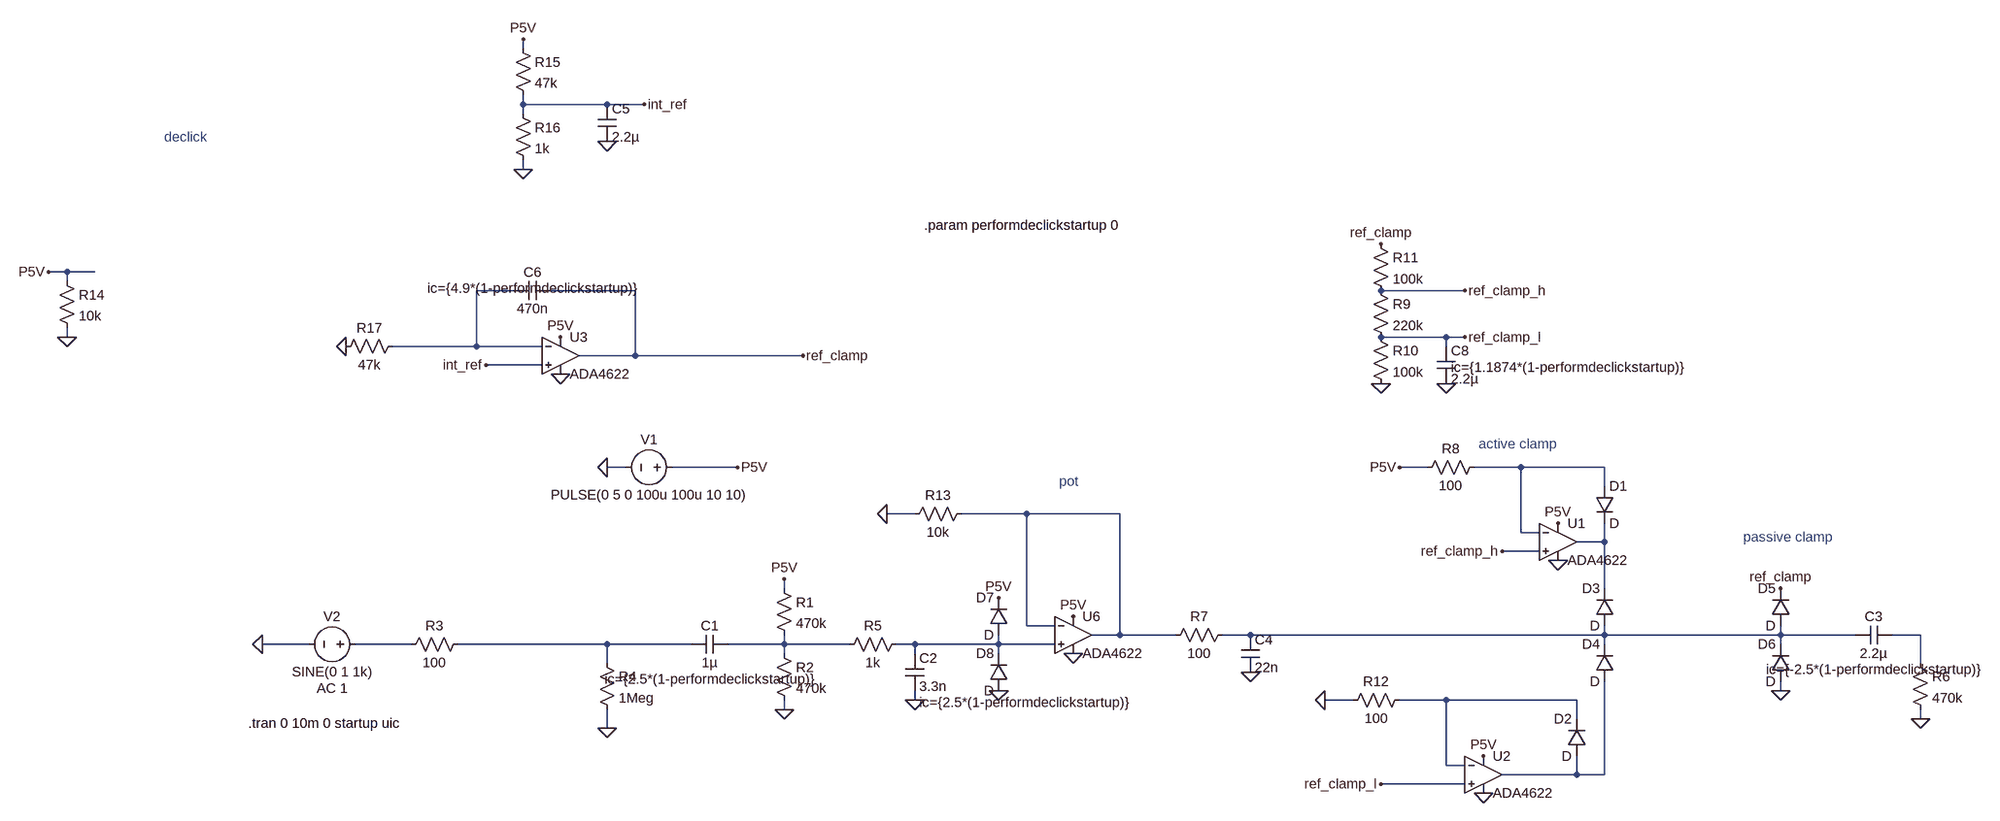
[diagram p0: schematic plugnslay.asc]
plugnslay.asc, the LTspice schematic file:
Version 4
SHEET 1 2460 852
WIRE -128 -560 -128 -576
WIRE -128 -464 -128 -480
WIRE 16 -464 -128 -464
WIRE 80 -464 16 -464
WIRE -128 -448 -128 -464
WIRE -128 -352 -128 -368
WIRE -976 -176 -1008 -176
WIRE -928 -176 -976 -176
WIRE -976 -160 -976 -176
WIRE -144 -144 -208 -144
WIRE 64 -144 -80 -144
WIRE 1488 -144 1344 -144
WIRE -976 -64 -976 -80
WIRE 1456 -64 1344 -64
WIRE 1488 -64 1456 -64
WIRE -208 -48 -208 -144
WIRE -208 -48 -352 -48
WIRE -96 -48 -208 -48
WIRE 1456 -48 1456 -64
WIRE 64 -32 64 -144
WIRE 64 -32 -32 -32
WIRE 352 -32 64 -32
WIRE -96 -16 -192 -16
WIRE 48 160 16 160
WIRE 240 160 128 160
WIRE 1424 160 1376 160
WIRE 1584 160 1504 160
WIRE 1728 160 1584 160
WIRE 1728 192 1728 160
WIRE 544 240 496 240
WIRE 736 240 624 240
WIRE 896 240 736 240
WIRE 1584 272 1584 160
WIRE 1616 272 1584 272
WIRE 1728 288 1728 256
WIRE 1728 288 1680 288
WIRE 1616 304 1552 304
WIRE 320 368 320 352
WIRE 1728 368 1728 288
WIRE 736 432 736 240
WIRE 784 432 736 432
WIRE 896 448 896 240
WIRE 896 448 848 448
WIRE 992 448 896 448
WIRE 1120 448 1072 448
WIRE 1728 448 1728 432
WIRE 1728 448 1120 448
WIRE 2080 448 2080 432
WIRE 2080 448 1728 448
WIRE 2208 448 2080 448
WIRE 2320 448 2272 448
WIRE -496 464 -576 464
WIRE -320 464 -416 464
WIRE 16 464 -240 464
WIRE 160 464 16 464
WIRE 320 464 320 448
WIRE 320 464 224 464
WIRE 432 464 320 464
WIRE 544 464 512 464
WIRE 688 464 688 448
WIRE 688 464 544 464
WIRE 784 464 688 464
WIRE 1728 464 1728 448
WIRE 2080 464 2080 448
WIRE 320 480 320 464
WIRE 544 480 544 464
WIRE 688 480 688 464
WIRE 16 496 16 464
WIRE 2320 496 2320 448
WIRE 2080 544 2080 528
WIRE 544 560 544 544
WIRE 1296 560 1248 560
WIRE 1456 560 1376 560
WIRE 1680 560 1456 560
WIRE 320 576 320 560
WIRE 1680 592 1680 560
WIRE 2320 592 2320 576
WIRE 16 608 16 576
WIRE 1456 672 1456 560
WIRE 1488 672 1456 672
WIRE 1680 688 1680 656
WIRE 1680 688 1552 688
WIRE 1728 688 1728 528
WIRE 1728 688 1680 688
WIRE 1488 704 1344 704
FLAG 16 160 0
FLAG 240 160 P5V
FLAG -576 464 0
FLAG 320 352 P5V
FLAG 320 576 0
FLAG 16 608 0
FLAG 816 416 P5V
FLAG 544 560 0
FLAG 1648 256 P5V
FLAG 1648 320 0
FLAG 1376 160 P5V
FLAG 1344 16 0
FLAG 1488 -144 ref_clamp_h
FLAG 1488 -64 ref_clamp_l
FLAG 1552 304 ref_clamp_h
FLAG 1520 656 P5V
FLAG 1520 720 0
FLAG 1344 704 ref_clamp_l
FLAG 1248 560 0
FLAG 2320 592 0
FLAG 1120 512 0
FLAG 2080 544 0
FLAG -1008 -176 P5V
FLAG -64 -64 P5V
FLAG -64 0 0
FLAG -976 -64 0
FLAG -128 -576 P5V
FLAG -128 -352 0
FLAG 80 -464 int_ref
FLAG -192 -16 int_ref
FLAG 816 480 0
FLAG 1456 16 0
FLAG -432 -48 0
FLAG 352 -32 ref_clamp
FLAG 1344 -224 ref_clamp
FLAG 2080 368 ref_clamp
FLAG 16 -400 0
FLAG 496 240 0
FLAG 688 384 P5V
FLAG 688 544 0
SYMBOL voltage 144 160 R90
WINDOW 0 -32 56 VBottom 2
WINDOW 3 32 56 VTop 2
WINDOW 123 0 0 Left 0
WINDOW 39 0 0 Left 0
SYMATTR InstName V1
SYMATTR Value PULSE(0 5 0 100u 100u 10 10)
SYMBOL cap 224 448 R90
WINDOW 0 0 32 VBottom 2
WINDOW 3 32 32 VTop 2
WINDOW 123 60 32 VTop 2
SYMATTR InstName C1
SYMATTR Value 1µ
SYMATTR Value2 ic={2.5*(1-performdeclickstartup)}
SYMBOL voltage -400 464 R90
WINDOW 0 -32 56 VBottom 2
WINDOW 3 32 56 VTop 2
WINDOW 123 60 56 VTop 2
WINDOW 39 0 0 Left 0
SYMATTR InstName V2
SYMATTR Value SINE(0 1 1k)
SYMATTR Value2 AC 1
SYMBOL res 304 352 R0
SYMATTR InstName R1
SYMATTR Value 470k
SYMBOL res 304 464 R0
SYMATTR InstName R2
SYMATTR Value 470k
SYMBOL res -224 448 R90
WINDOW 0 0 56 VBottom 2
WINDOW 3 32 56 VTop 2
SYMATTR InstName R3
SYMATTR Value 100
SYMBOL res 0 480 R0
SYMATTR InstName R4
SYMATTR Value 1Meg
SYMBOL cap 528 480 R0
WINDOW 123 24 84 Left 2
SYMATTR InstName C2
SYMATTR Value 3.3n
SYMATTR Value2 ic={2.5*(1-performdeclickstartup)}
SYMBOL res 528 448 R90
WINDOW 0 0 56 VBottom 2
WINDOW 3 32 56 VTop 2
SYMATTR InstName R5
SYMATTR Value 1k
SYMBOL diode 1712 192 R0
SYMATTR InstName D1
SYMBOL res 1088 432 R90
WINDOW 0 0 56 VBottom 2
WINDOW 3 32 56 VTop 2
SYMATTR InstName R7
SYMATTR Value 100
SYMBOL res 1520 144 R90
WINDOW 0 0 56 VBottom 2
WINDOW 3 32 56 VTop 2
SYMATTR InstName R8
SYMATTR Value 100
SYMBOL diode 1744 432 R180
WINDOW 0 24 64 Left 2
WINDOW 3 24 0 Left 2
SYMATTR InstName D3
SYMBOL res 1328 -160 R0
SYMATTR InstName R9
SYMATTR Value 220k
SYMBOL res 1328 -80 R0
SYMATTR InstName R10
SYMATTR Value 100k
SYMBOL res 1328 -240 R0
SYMATTR InstName R11
SYMATTR Value 100k
SYMBOL diode 1696 656 R180
WINDOW 0 24 64 Left 2
WINDOW 3 24 0 Left 2
SYMATTR InstName D2
SYMBOL res 1392 544 R90
WINDOW 0 0 56 VBottom 2
WINDOW 3 32 56 VTop 2
SYMATTR InstName R12
SYMATTR Value 100
SYMBOL diode 1744 528 R180
WINDOW 0 24 64 Left 2
WINDOW 3 24 0 Left 2
SYMATTR InstName D4
SYMBOL res 2304 480 R0
SYMATTR InstName R6
SYMATTR Value 470k
SYMBOL cap 2272 432 R90
WINDOW 0 0 32 VBottom 2
WINDOW 3 32 32 VTop 2
WINDOW 123 60 32 VTop 2
SYMATTR InstName C3
SYMATTR Value 2.2µ
SYMATTR Value2 ic={-2.5*(1-performdeclickstartup)}
SYMBOL cap 1104 448 R0
SYMATTR InstName C4
SYMATTR Value 22n
SYMATTR Value2 ic={2.5*(1-performdeclickstartup)}
SYMBOL diode 2096 432 R180
WINDOW 0 24 64 Left 2
WINDOW 3 24 0 Left 2
SYMATTR InstName D5
SYMBOL diode 2096 528 R180
WINDOW 0 24 64 Left 2
WINDOW 3 24 0 Left 2
SYMATTR InstName D6
SYMBOL res -992 -176 R0
SYMATTR InstName R14
SYMATTR Value 10k
SYMBOL res -144 -576 R0
SYMATTR InstName R15
SYMATTR Value 47k
SYMBOL res -144 -464 R0
SYMATTR InstName R16
SYMATTR Value 1k
SYMBOL cap 1440 -48 R0
WINDOW 123 24 36 Left 2
SYMATTR InstName C8
SYMATTR Value 2.2µ
SYMATTR Value2 ic={1.1874*(1-performdeclickstartup)}
SYMBOL cap -80 -160 R90
WINDOW 0 0 32 VBottom 2
WINDOW 3 32 32 VTop 2
WINDOW 123 28 32 VBottom 2
SYMATTR InstName C6
SYMATTR Value 470n
SYMATTR Value2 ic={4.9*(1-performdeclickstartup)}
SYMBOL res -336 -64 R90
WINDOW 0 0 56 VBottom 2
WINDOW 3 32 56 VTop 2
SYMATTR InstName R17
SYMATTR Value 47k
SYMBOL cap 0 -464 R0
SYMATTR InstName C5
SYMATTR Value 2.2µ
SYMBOL res 640 224 R90
WINDOW 0 0 56 VBottom 2
WINDOW 3 32 56 VTop 2
SYMATTR InstName R13
SYMATTR Value 10k
SYMBOL OpAmps\\ADA4622 816 384 R0
SYMATTR InstName U6
SYMBOL OpAmps\\ADA4622 1648 224 R0
SYMATTR InstName U1
SYMBOL OpAmps\\ADA4622 1520 624 R0
SYMATTR InstName U2
SYMBOL OpAmps\\ADA4622 -64 -96 R0
SYMATTR InstName U3
SYMBOL diode 704 448 R180
WINDOW 0 24 64 Left 2
WINDOW 3 24 0 Left 2
SYMATTR InstName D7
SYMBOL diode 704 544 R180
WINDOW 0 24 64 Left 2
WINDOW 3 24 0 Left 2
SYMATTR InstName D8
TEXT -600 600 Left 2 !.tran 0 10m 0 startup uic
TEXT 1512 120 Left 2 ;active clamp
TEXT 2016 280 Left 2 ;passive clamp
TEXT -744 -408 Left 2 ;declick
TEXT 792 184 Left 2 ;pot
TEXT 560 -256 Left 2 !.param performdeclickstartup 0

The netlist it stands for:
* plugnslay.asc
V1 P5V 0 PULSE(0 5 0 100u 100u 10 10)
C1 N009 N008 1µ ic={2.5*(1-performdeclickstartup)}
V2 N007 0 SINE(0 1 1k) AC 1
R1 P5V N009 470k
R2 N009 0 470k
R3 N008 N007 100
R4 N008 0 1Meg
C2 N010 0 3.3n ic={2.5*(1-performdeclickstartup)}
R5 N010 N009 1k
D1 N002 N004 D
R7 N005 N003 100
R8 N002 P5V 100
D3 N005 N004 D
R9 ref_clamp_h ref_clamp_l 220k
R10 ref_clamp_l 0 100k
R11 ref_clamp ref_clamp_h 100k
D2 N012 N011 D
R12 N011 0 100
D4 N012 N005 D
R6 N006 0 470k
C3 N006 N005 2.2µ ic={-2.5*(1-performdeclickstartup)}
C4 N005 0 22n ic={2.5*(1-performdeclickstartup)}
D5 N005 ref_clamp D
D6 0 N005 D
R14 P5V 0 10k
R15 P5V int_ref 47k
R16 int_ref 0 1k
C8 ref_clamp_l 0 2.2µ ic={1.1874*(1-performdeclickstartup)}
C6 ref_clamp N001 470n ic={4.9*(1-performdeclickstartup)}
R17 N001 0 47k
C5 int_ref 0 2.2µ
R13 N003 0 10k
XU6 N010 N003 P5V 0 N003 ADA4622  ; pins In+ In- V+ V- OUT
XU1 ref_clamp_h N002 P5V 0 N004 ADA4622  ; pins In+ In- V+ V- OUT
XU2 ref_clamp_l N011 P5V 0 N012 ADA4622  ; pins In+ In- V+ V- OUT
XU3 int_ref N001 P5V 0 ref_clamp ADA4622  ; pins In+ In- V+ V- OUT
D7 N010 P5V D
D8 0 N010 D
.model D D
.lib standard.dio
.tran 0 10m 0 startup uic
* active clamp
* passive clamp
* declick
* pot
.param performdeclickstartup 0
.lib ADA4622.lib
.backanno
.end